# Altium schematic sheet lab1schemat.SchDoc
size A4
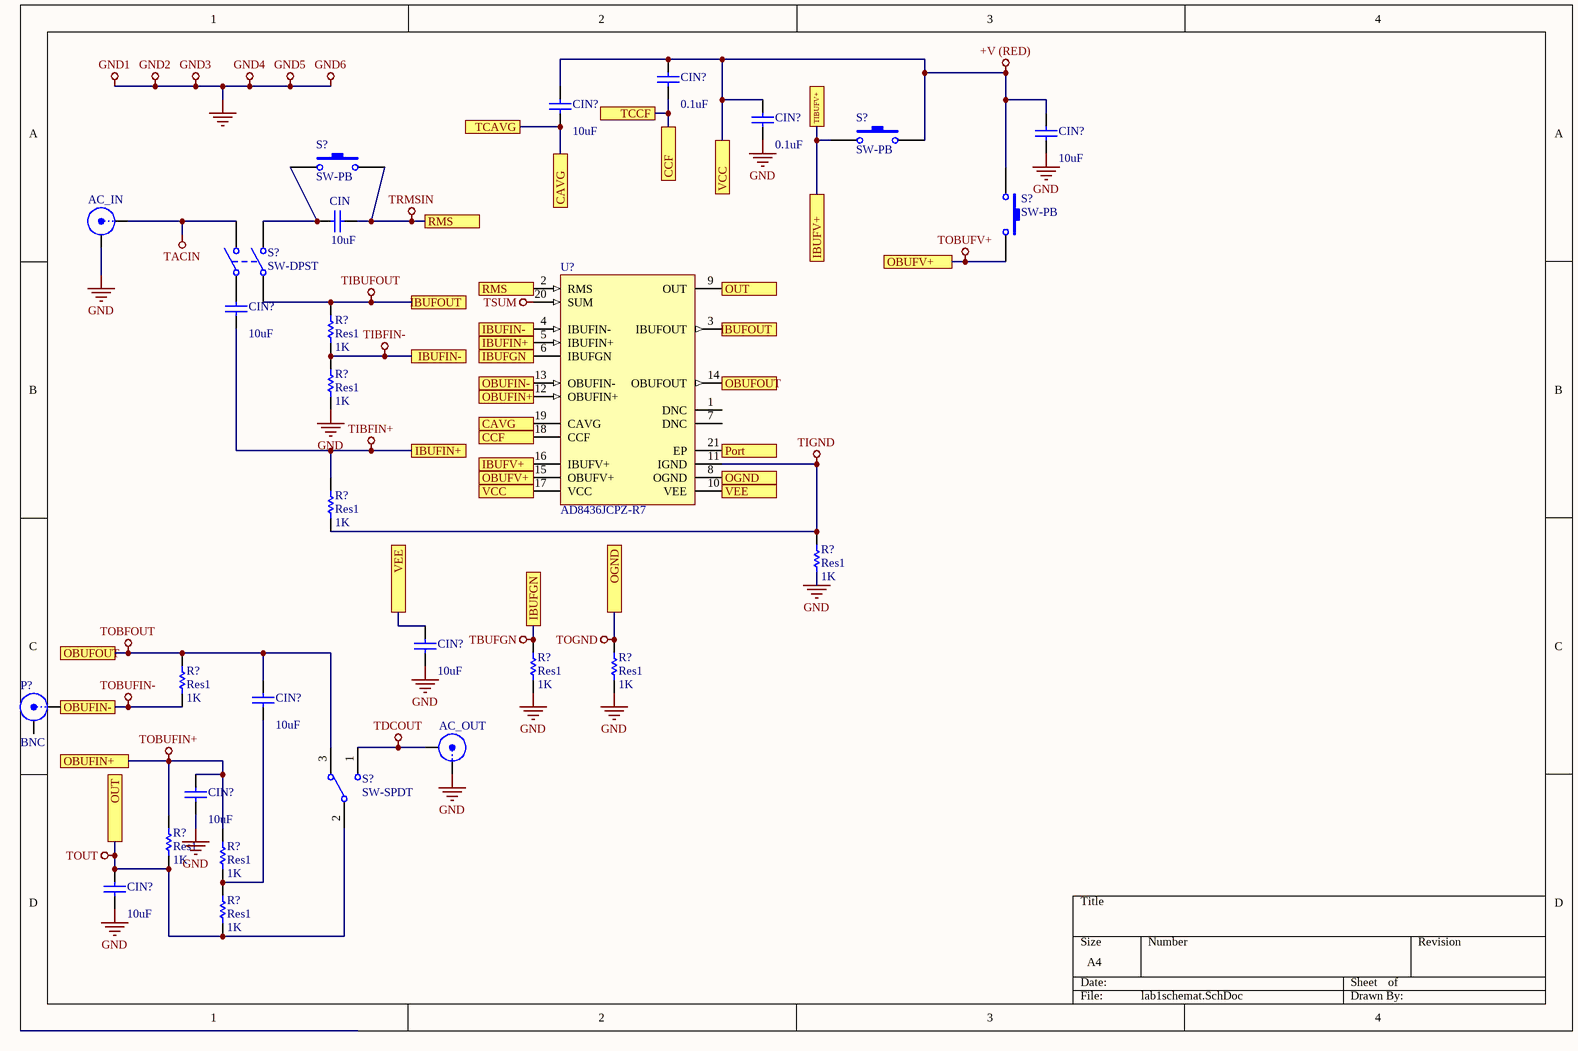
[diagram p0: lab1schemat.SchDoc]

## Parts
(Parts that share a designator on the sheet are numbered #1, #2 ... from top to bottom, then left to right.)
AC_IN  (no value)  [BNC_RA CON]
AC_OUT  (no value)  [BNC_RA CON]
CIN  value 10uF  [RAD-0.3]
CIN?#1  value 0.1uF  [RAD-0.3]
CIN?#2  value 10uF  [RAD-0.3]
CIN?#3  value 0.1uF  [RAD-0.3]
CIN?#4  value 10uF  [RAD-0.3]
CIN?#5  value 10uF  [RAD-0.3]
CIN?#6  value 10uF  [RAD-0.3]
CIN?#7  value 10uF  [RAD-0.3]
CIN?#8  value 10uF  [RAD-0.3]
CIN?#9  value 10uF  [RAD-0.3]
P?  BNC  [BNC_RA CON]
R?#1  Res1  value 1K  [AXIAL-0.3]
R?#2  Res1  value 1K  [AXIAL-0.3]
R?#3  Res1  value 1K  [AXIAL-0.3]
R?#4  Res1  value 1K  [AXIAL-0.3]
R?#5  Res1  value 1K  [AXIAL-0.3]
R?#6  Res1  value 1K  [AXIAL-0.3]
R?#7  Res1  value 1K  [AXIAL-0.3]
R?#8  Res1  value 1K  [AXIAL-0.3]
R?#9  Res1  value 1K  [AXIAL-0.3]
R?#10  Res1  value 1K  [AXIAL-0.3]
S?#1  SW-PB  [SPST-2]
S?#2  SW-PB  [SPST-2]
S?#3  SW-PB  [SPST-2]
S?#4  SW-DPST  [DPST-4]
S?#5  SW-SPDT  [TL36WW15050]
U?  AD8436JCPZ-R7  [ADI-CP-20-10_N]

## Ports
CAVG, CCF, IBUFGN, IBUFIN+, IBUFIN-, IBUFOUT, IBUFV+, OBUFIN+, OBUFIN-, OBUFOUT, OBUFV+, OGND, OUT, Port, RMS, TCAVG, TCCF, TIBUFV+, VCC, VEE

## Nets
+V (RED): CIN?#1.2 CIN?#2.2 CIN?#3.2 CIN?#4.2 S?#1.2 S?#3.1 U?.17(VCC) ; port VCC
GND: AC_IN.2(Y) AC_OUT.1(X) CIN?#3.1 CIN?#4.1 CIN?#6.1 CIN?#8.1 CIN?#9.1 R?#2.1 R?#4.1 R?#5.1 R?#6.1
TACIN: AC_IN.1(X) S?#4.2(NO1)
TBUFGN: R?#5.2 U?.6(IBUFGN) ; port IBUFGN
TDCOUT: AC_OUT.2(Y) S?#5.1
TIBFIN+: CIN?#5.1 R?#3.2 U?.5(IBUFIN+) ; port IBUFIN+
TIBFIN-: R?#1.1 R?#2.2 U?.4(IBUFIN-) ; port IBUFIN-
TIBUFOUT: R?#1.2 S?#4.3(COMMON2) U?.3(IBUFOUT) ; port IBUFOUT
TIGND: R?#3.1 R?#4.2 U?.11(IGND)
TOBFOUT: CIN?#7.2 R?#7.2 S?#5.3 U?.14(OBUFOUT) ; port OBUFOUT
TOBUFIN+: CIN?#8.2 R?#8.2 R?#9.2 U?.12(OBUFIN+) ; port OBUFIN+
TOBUFIN-: P?.1(X) R?#7.1 U?.13(OBUFIN-) ; port OBUFIN-
TOBUFV+: S?#3.2 U?.15(OBUFV+) ; port OBUFV+
TOGND: R?#6.2 U?.8(OGND) ; port OGND
TOUT: CIN?#9.2 R?#8.1 R?#10.1 S?#5.2 U?.9(OUT) ; port OUT
TRMSIN: CIN.2 S?#2.2 U?.2(RMS) ; port RMS
TSUM: U?.20(SUM)
CAVG: CIN?#2.1 U?.19(CAVG) ; port CAVG, port TCAVG
CCF: CIN?#1.1 U?.18(CCF) ; port CCF, port TCCF
IBUFV+: S?#1.1 U?.16(IBUFV+) ; port IBUFV+, port TIBUFV+
Port: U?.21(EP) ; port Port
VEE: CIN?#6.2 U?.10(VEE) ; port VEE
NetCIN?#7_1: CIN?#7.1 R?#9.1 R?#10.2
NetCIN_1: CIN.1 S?#2.1 S?#4.4(NO2)

Not connected (* = marked no-connect by the designer): CIN?#5 2; P? 2(Y); S?#4 1(COMMON1); U? 1(DNC) 7(DNC)

## Library data of the parts
AC_IN AC_OUT P? = BNC: BNC Elbow Connector; LatestRevisionDate: 17-Jul-2002; LatestRevisionNote: Re-released for DXP Platform.; Publisher: Altium Limited
CIN CIN?#1-CIN?#9 = Cap: Published: 8-Jun-2000; LatestRevisionDate: 17-Jul-2002; LatestRevisionNote: Re-released for DXP Platform.; PackageReference: RAD-0.3; Publisher: Altium Limited; PackageDescription: Radial Cap, Thru-Hole; 2 Leads; 0.3 in Pin Spacing
R?#1-R?#10 = Res1: Resistor; Published: 8-Jun-2000; LatestRevisionDate: 17-Jul-2002; LatestRevisionNote: Re-released for DXP Platform.; PackageReference: AXIAL-0.3; Publisher: Altium Limited; PackageDescription: Axial Device, Thru-Hole; 2 Leads; 0.3 in Pin Spacing
S?#1-S?#3 = SW-PB: Switch; Published: 24-Mar-1999; LatestRevisionDate: 17-Jul-2002; LatestRevisionNote: Re-released for DXP Platform.; PackageReference: SPST-2; Publisher: Altium Limited; PackageDescription: Switch; 2 Leads
S?#4 = SW-DPST: Double-Pole, Single-Throw Switch; Published: 24-Mar-1999; LatestRevisionDate: 17-Jul-2002; LatestRevisionNote: Re-released for DXP Platform.; PackageReference: DPST-4; Publisher: Altium Limited; PackageDescription: Switch; 4 Leads
S?#5 = SW-SPDT: SPDT Subminiature Toggle Switch, Right Angle Mounting, Vertical Actuation; Published: 24-Mar-1999; LatestRevisionDate: 17-Dec-2003; LatestRevisionNote: Schematic revised, PCB Footprint replaced.; DatasheetVersion: 05-Dec-2000; PackageReference: TL36WW15050; Publisher: Altium Limited; PackageDescription: Switch; 4 Leads; ComponentLink1Description: Manufacturer Link; ComponentLink1URL: http://www.apem.com
U? = CMP-0527-00006-3: Low Cost, Low Power, True RMS-to-DC Converter, 4.8 to 36 V Single Supply, 0 to 70 degC, 20-Pin QFN (CP-20-10); Manufacturer: Analog Devices; V Span (min): 4.8 V; Max Vin (V-rms): 3 V rms; Error (%@ CF: 3)=0.5; V Span (max): 36 V; -3dB Bandwidth: 950 KHz; Supply Current: 300 uA; PartNumber: AD8436JCPZ-R7; ComponentLink2Description: Datasheet; PackageDescription: 20-Pin Frame Chip Scale Package, Body 4 x 4 mm, Pitch 0.5 mm; ComponentLink3Description: Package Specification; PackageReference: CP-20-10; PackageVersion: Rev. B; ComponentLink1URL: http://www.analog.com/; RoHS: TRUE; DatasheetVersion: Rev. B; ComponentLink1Description: Manufacturer URL; ComponentLink3URL: http://www.analog.com/static/imported-files/packages/PKG_PDF/LFCSP(CP)/CP_20_10.pdf; Mounting Technology: Surface Mount; ComponentLink2URL: http://www.analog.com/static/imported-files/data_sheets/AD8436.pdf; Operating Temperature Range: 0 to 70 degC